# EAGLE design temp_sensor (EAGLE 9.1.0)
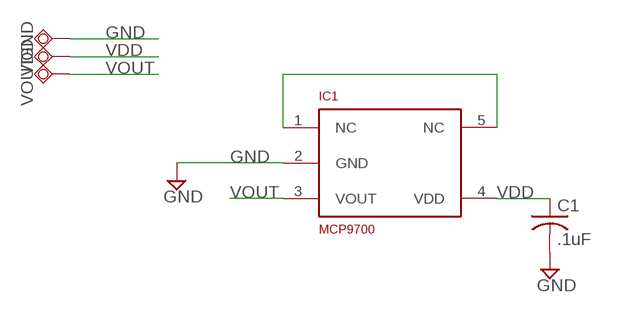
[diagram p0: schematic, sheet 1]

## Parts
C1  .1uF  C-USC0805K  [C0805K]
GND  TPSQTP20SQ  [TP20SQ]
IC1  MCP9700  [SC70]
VDD  TPSQTP20SQ  [TP20SQ]
VOUT  TPSQTP20SQ  [TP20SQ]

## Nets
GND: C1.2 GND.TP IC1.2(GND)
THERM: IC1.1(NC) IC1.5(NC)
VDD: C1.1 IC1.4(VDD) VDD.TP
VOUT: IC1.3(VOUT) VOUT.TP

## Library data of the parts
C1 = rcl:C-US: CAPACITOR, American symbol; SPICEPREFIX: C
GND VDD VOUT = testpad:TPSQ: Test pad
IC1 = vtgs:MCP9700

## Board
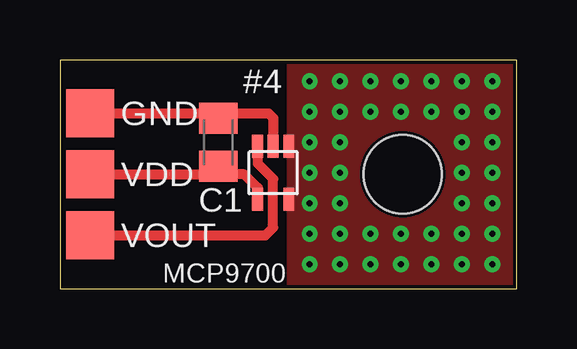
[diagram p1: board, top side]
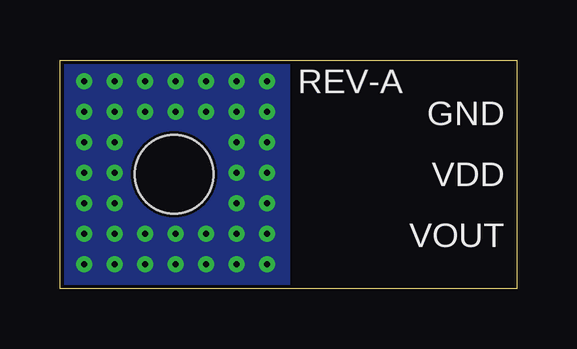
[diagram p2: board, bottom side, seen from below]

Size 19.05 x 9.53 mm. Coordinates in mm from the lower left corner, seen from the top.
Outline: 0,0 19.05,0 19.05,9.53 0,9.53 0,0
Copper layers (1*16): Top 0.035mm / dielectric 1.5mm / Bottom 0.035mm
Design rules "default *": minimum track width 6mil, minimum drill 0.35mm, track to track 6mil, track to pad 6mil, pad to pad 6mil, via to via 6mil, smd to smd 6mil, copper to edge 6mil, drill to drill 6mil, minimum pad ring 10mil, minimum via ring 8mil, stop-mask expansion 4mil, vias tented up to drill 0mil, thermal gap 10mil
Holes 3.26 mm at 14.29,4.76

### Footprints (pad centres in the part's own frame; a part is rotated, then mirrored left to right if it is on the bottom)
C0805K = smd 1.3 x 1.6: 1 -1,0; 2 1,0
TP20SQ = smd 2 x 2: TP 0,0
SC70 = smd 0.45 x 0.95: 1 0.65,1.1; 2 0,1.1; 3 -0.65,1.1; 4 -0.65,-1.1; 5 0.65,-1.1

### Placement (x,y rotation side)
C1  6.6,6.1 90 top
GND  1.27,7.3 0 top
IC1  8.89,4.83 0 top
VDD  1.27,4.76 0 top
VOUT  1.27,2.22 0 top

### Tracks (layer width: path | path; a pad name or v marks a point on that pad's centre or on a via)
GND
  Top 0.406: 6.6,7.3 8.7,7.3 8.89,7.11 IC1.2 | C1.2 6.6,7.3 | GND.TP 6.6,7.3
THERM  (via drill 0.25)
  other vias: 12.95,1.02 14.22,1.02 15.49,1.02 16.76,1.02 18.03,1.02 18.03,2.29 18.03,3.56 18.03,4.83 18.03,6.1 18.03,7.37 18.03,8.64 16.76,8.64 15.49,8.64 10.41,2.29 14.22,8.64 10.41,1.02 11.68,1.02 12.95,8.64 11.68,8.64 10.41,8.64 10.41,7.37 10.41,6.1 10.41,4.83 10.41,3.56 11.68,7.37 16.76,7.37 16.76,2.29 11.68,2.29 11.68,6.1 12.95,7.37 15.49,7.37 16.76,6.1 16.76,3.56 15.49,2.29 12.95,2.29 11.68,3.56 11.68,4.83 14.22,2.29 16.76,4.83 14.22,7.37
  pour Top (no thermals): 9.53,9.53 19.05,9.53 19.05,0 9.53,0
  pour Bottom: 9.53,0 9.53,9.53 19.05,9.53 19.05,0
VDD
  Top 0.406: IC1.4 8.24,4.21 7.68,4.76 6.6,4.76 C1.1 6.27,4.76 VDD.TP
VOUT
  Top 0.406: IC1.3 8.24,5.22 8.89,4.57 8.89,2.54 8.57,2.22 VOUT.TP

### Text on the board
tNames: #4
bNames: REV-A | GND | VDD | VOUT